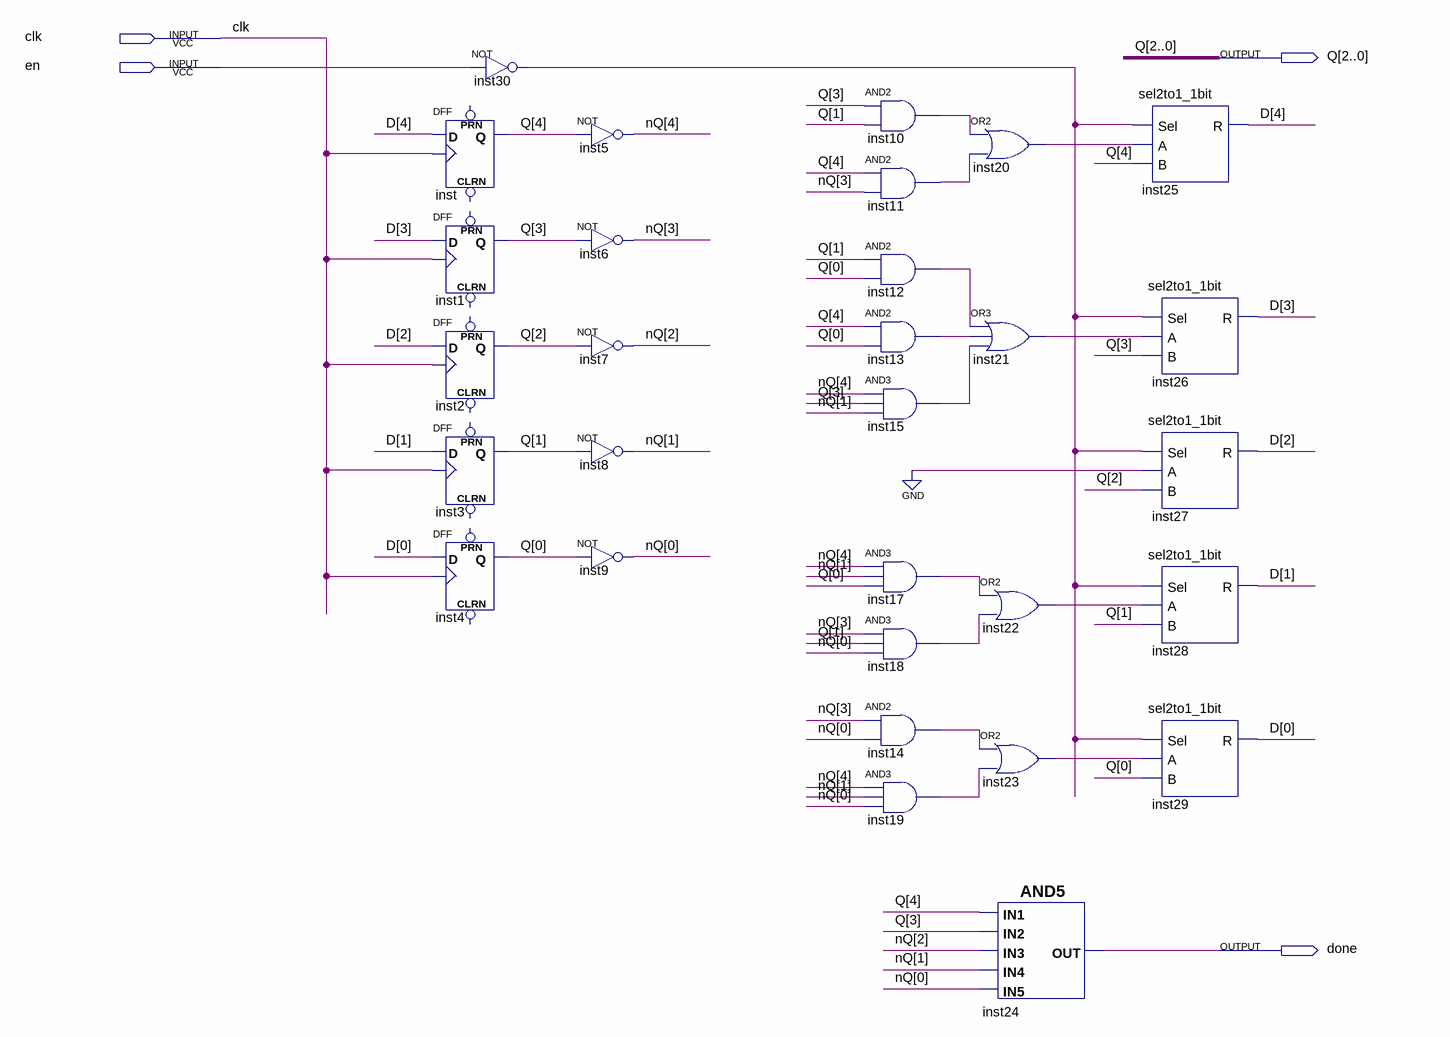
[diagram p0: schematic sheet]
// Quartus schematic counter.bdf as structural Verilog: 30 symbols, 4 pins
module counter (
  input  clk,
  input  en,
  output [4:0] Q,
  output done
);

  wire inst10_out, inst11_out, inst12_out, inst13_out, inst14_out, inst15_out, inst17_out, inst18_out,
       inst19_out, inst20_out, inst21_out, inst22_out, inst23_out, inst30_out;
  wire [4:0] D, nQ;

  DFF inst (.CLK(clk), .D(D[4]), .Q(Q[4]));  // open: CLRN, PRN
  DFF inst1 (.CLK(clk), .D(D[3]), .Q(Q[3]));  // open: CLRN, PRN
  DFF inst2 (.CLK(clk), .D(D[2]), .Q(Q[2]));  // open: CLRN, PRN
  DFF inst3 (.CLK(clk), .D(D[1]), .Q(Q[1]));  // open: CLRN, PRN
  DFF inst4 (.CLK(clk), .D(D[0]), .Q(Q[0]));  // open: CLRN, PRN
  not inst30 (inst30_out, en);
  not inst5 (nQ[4], Q[4]);
  not inst6 (nQ[3], Q[3]);
  not inst7 (nQ[2], Q[2]);
  not inst8 (nQ[1], Q[1]);
  not inst9 (nQ[0], Q[0]);
  and inst10 (inst10_out, Q[3], Q[1]);
  and inst11 (inst11_out, Q[4], nQ[3]);
  and inst12 (inst12_out, Q[1], Q[0]);
  and inst13 (inst13_out, Q[4], Q[0]);
  and inst15 (inst15_out, nQ[4], Q[3], nQ[1]);
  and inst17 (inst17_out, nQ[4], nQ[1], Q[0]);
  and inst18 (inst18_out, nQ[3], Q[1], nQ[0]);
  and inst14 (inst14_out, nQ[3], nQ[0]);
  and inst19 (inst19_out, nQ[4], nQ[1], nQ[0]);
  or inst20 (inst20_out, inst10_out, inst11_out);
  or inst21 (inst21_out, inst12_out, inst13_out, inst15_out);
  or inst22 (inst22_out, inst17_out, inst18_out);
  or inst23 (inst23_out, inst14_out, inst19_out);
  and inst24 (done, Q[4], Q[3], nQ[2], nQ[1], nQ[0]);
  sel2to1_1bit inst25 (.Sel(inst30_out), .A(inst20_out), .B(Q[4]), .R(D[4]));
  sel2to1_1bit inst26 (.Sel(inst30_out), .A(inst21_out), .B(Q[3]), .R(D[3]));
  sel2to1_1bit inst27 (.Sel(inst30_out), .A(1'b0), .B(Q[2]), .R(D[2]));
  sel2to1_1bit inst28 (.Sel(inst30_out), .A(inst22_out), .B(Q[1]), .R(D[1]));
  sel2to1_1bit inst29 (.Sel(inst30_out), .A(inst23_out), .B(Q[0]), .R(D[0]));
endmodule
